# Altium project SPA_module.PrjPcb
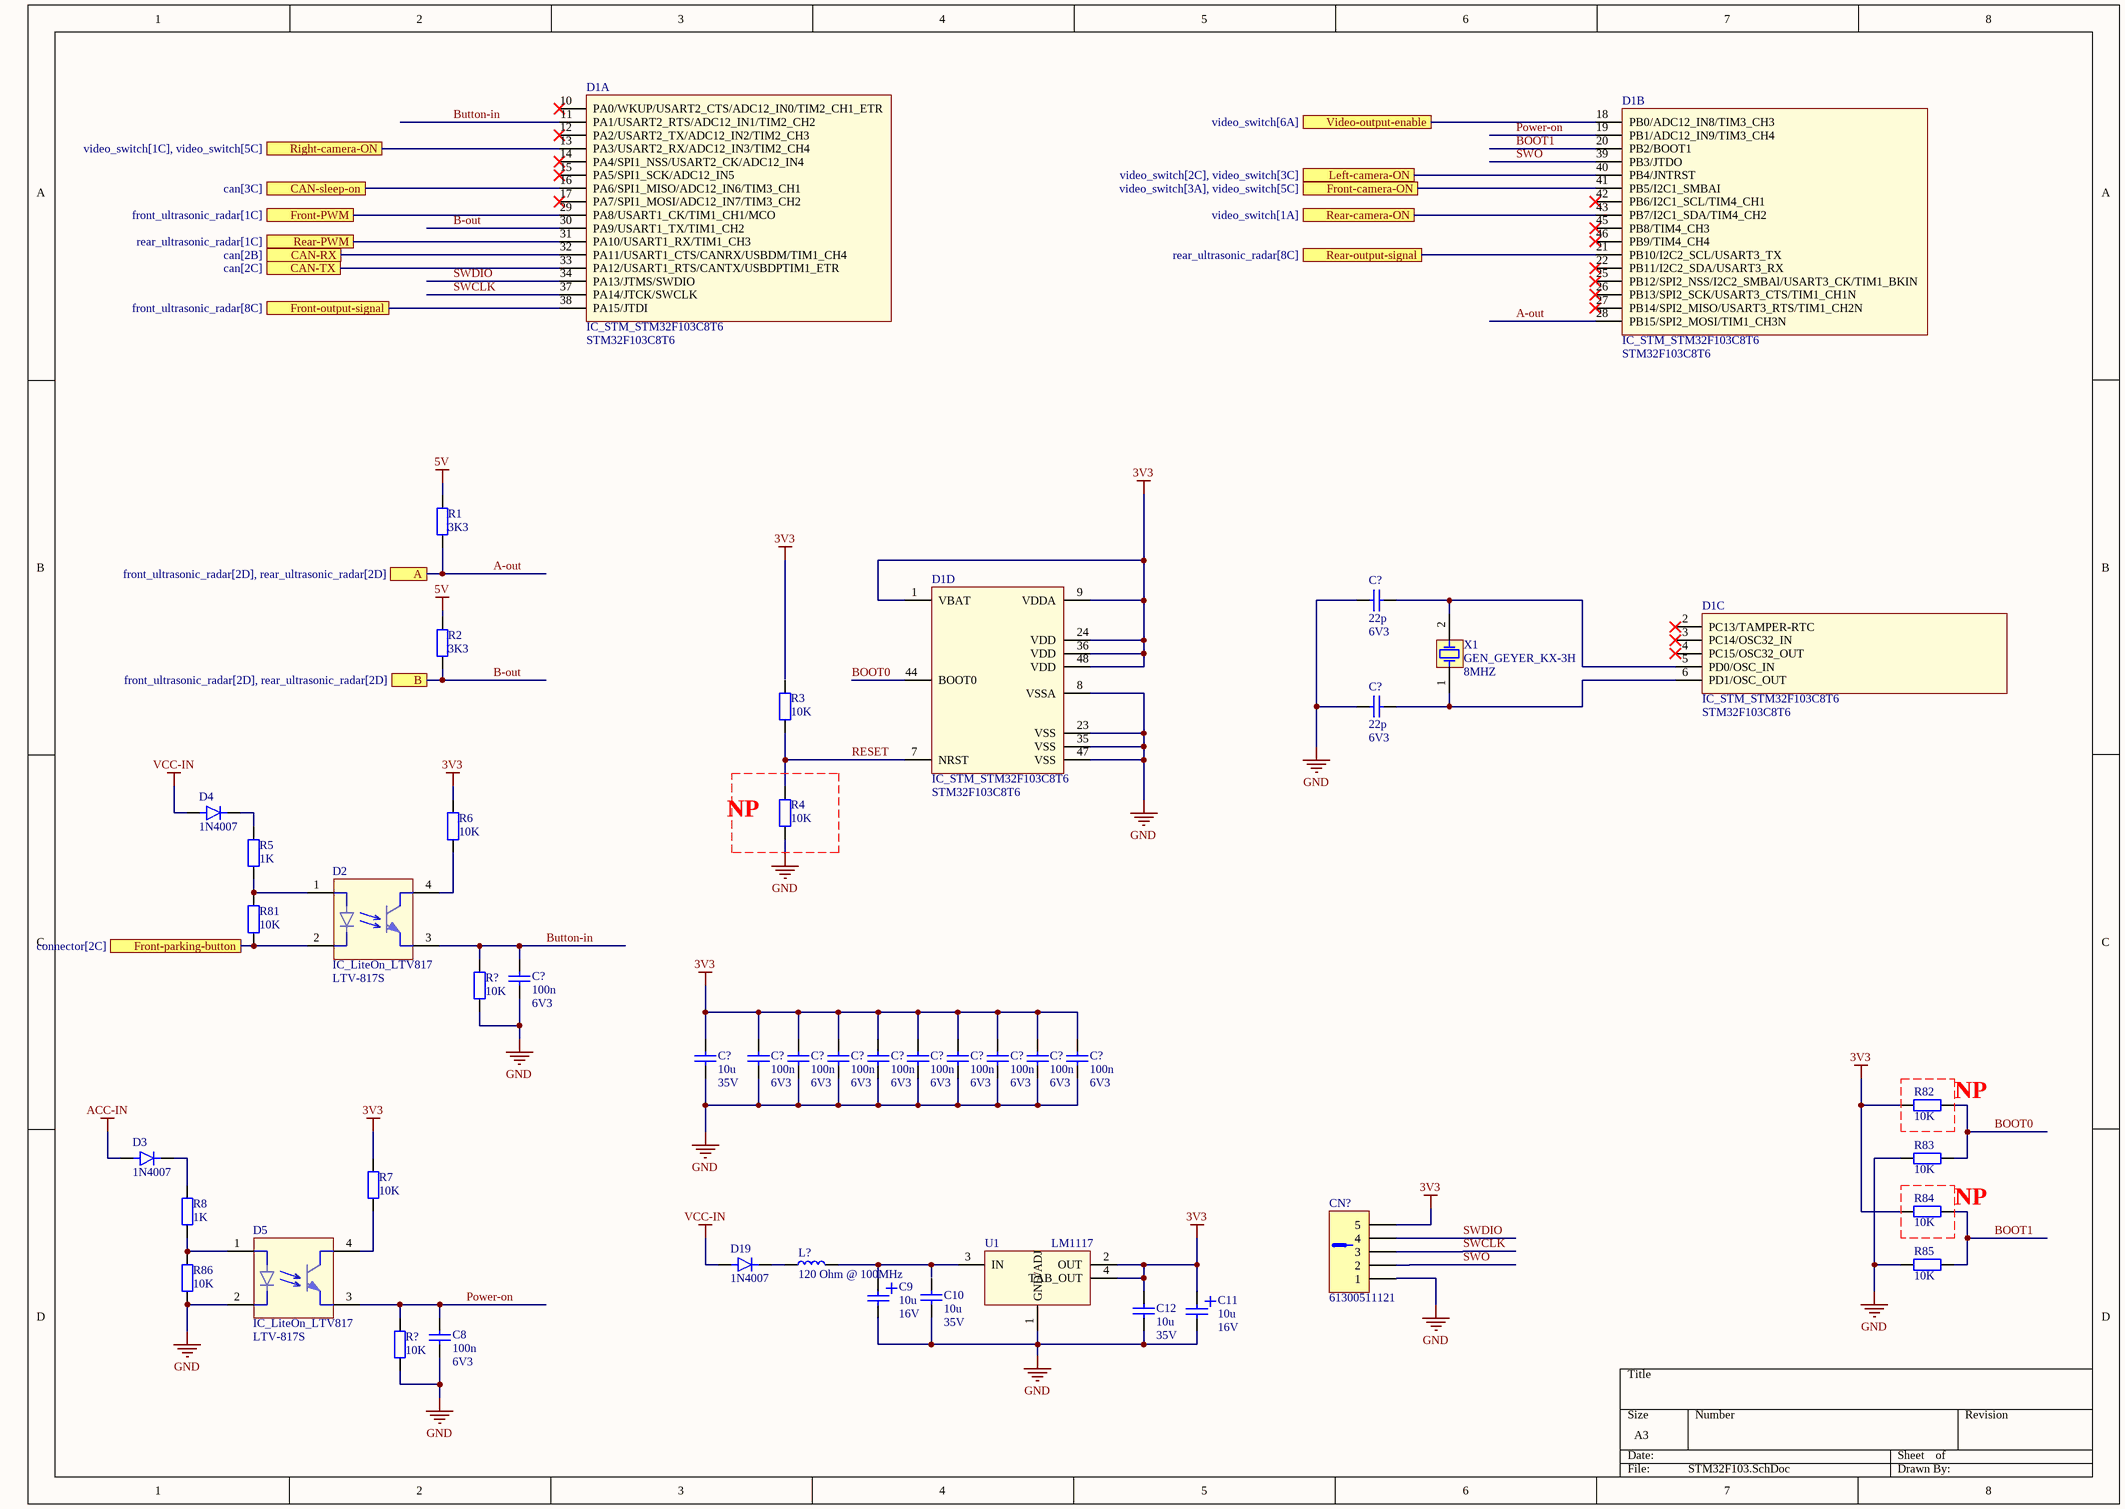
[diagram p0: STM32F103.SchDoc]
5 sheets, 153 parts. Net scope: flat (ports and power ports of the same name join across sheets).
Sheets:
  STM32F103.SchDoc
  can.SchDoc
  front_ultrasonic_radar.SchDoc
  connector.SchDoc
  rear_ultrasonic_radar.SchDoc

## Sheet STM32F103.SchDoc
size A3; SheetNumber: 1; SheetTotal: 6

### Parts
(Parts that share a designator on the sheet are numbered #1, #2 ... from top to bottom, then left to right.)
C8  Value1: 100n  Value2: 6V3  [CAPC2012X88N]  (hidden comment: CAP)
C9  Value1: 10u  Value2: 16V  [CAPAE430X550N]  (hidden comment: CAP_POL)
C10  Value1: 10u  Value2: 35V  [CAPC3216X18N]  (hidden comment: CAP)
C11  Value1: 10u  Value2: 16V  [CAPAE430X550N]  (hidden comment: CAP_POL)
C12  Value1: 10u  Value2: 35V  [CAPC3216X18N]  (hidden comment: CAP)
C?#1  Value1: 22p  Value2: 6V3  [CAPC2012X88N]  (hidden comment: CAP)
C?#2  Value1: 22p  Value2: 6V3  [CAPC2012X88N]  (hidden comment: CAP)
C?#3  Value1: 100n  Value2: 6V3  [CAPC2012X88N]  (hidden comment: CAP)
C?#4  Value1: 10u  Value2: 35V  [CAPC3216X18N]  (hidden comment: CAP)
C?#5  Value1: 100n  Value2: 6V3  [CAPC2012X88N]  (hidden comment: CAP)
C?#6  Value1: 100n  Value2: 6V3  [CAPC2012X88N]  (hidden comment: CAP)
C?#7  Value1: 100n  Value2: 6V3  [CAPC2012X88N]  (hidden comment: CAP)
C?#8  Value1: 100n  Value2: 6V3  [CAPC2012X88N]  (hidden comment: CAP)
C?#9  Value1: 100n  Value2: 6V3  [CAPC2012X88N]  (hidden comment: CAP)
C?#10  Value1: 100n  Value2: 6V3  [CAPC2012X88N]  (hidden comment: CAP)
C?#11  Value1: 100n  Value2: 6V3  [CAPC2012X88N]  (hidden comment: CAP)
C?#12  Value1: 100n  Value2: 6V3  [CAPC2012X88N]  (hidden comment: CAP)
C?#13  Value1: 100n  Value2: 6V3  [CAPC2012X88N]  (hidden comment: CAP)
CN?  Value1: 61300511121  [CN_Wurth_61300511121]  (hidden comment: CN_1X5M)
D1  IC_STM_STM32F103C8T6  Value1: STM32F103C8T6  [TSQFP50P900X900X160-48N]  (parts A,B,C,D of 4)
D2  IC_LiteOn_LTV817  Value1: LTV-817S  [IC_LiteOn_ LTV-817S]
D3  Value1: 1N4007  [DO-214AC]  (hidden comment: DIO)
D4  Value1: 1N4007  [DO-214AC]  (hidden comment: DIO)
D5  IC_LiteOn_LTV817  Value1: LTV-817S  [IC_LiteOn_ LTV-817S]
D19  Value1: 1N4007  [DO-214AC]  (hidden comment: DIO)
L?  Value1: 120 Ohm @ 100MHz  [INDC1608X60N]  (hidden comment: IND)
R1  Value1: 3K3  [RESC2012X60N]  (hidden comment: RES)
R2  Value1: 3K3  [RESC2012X60N]  (hidden comment: RES)
R3  Value1: 10K  [RESC2012X60N]  (hidden comment: RES)
R4  Value1: 10K  [RESC2012X60N]  (hidden comment: RES)
R5  Value1: 1K  [RESC2012X60N]  (hidden comment: RES)
R6  Value1: 10K  [RESC2012X60N]  (hidden comment: RES)
R7  Value1: 10K  [RESC2012X60N]  (hidden comment: RES)
R8  Value1: 1K  [RESC2012X60N]  (hidden comment: RES)
R81  Value1: 10K  [RESC2012X60N]  (hidden comment: RES)
R82  Value1: 10K  [RESC2012X60N]  (hidden comment: RES)
R83  Value1: 10K  [RESC2012X60N]  (hidden comment: RES)
R84  Value1: 10K  [RESC2012X60N]  (hidden comment: RES)
R85  Value1: 10K  [RESC2012X60N]  (hidden comment: RES)
R86  Value1: 10K  [RESC2012X60N]  (hidden comment: RES)
R?#1  Value1: 10K  [RESC2012X60N]  (hidden comment: RES)
R?#2  Value1: 10K  [RESC2012X60N]  (hidden comment: RES)
U1  Value1: LM1117  [IC_TI_LM1117]  (hidden comment: IC_TI_LM1117)
X1  GEN_GEYER_KX-3H  Value1: 8MHZ  [GEN_GEYER_KX-3H]

### Ports
A (see front_ultrasonic_radar[2D], rear_ultrasonic_radar[2D]), B (see front_ultrasonic_radar[2D], rear_ultrasonic_radar[2D]), CAN-RX (see can[2B]), CAN-sleep-on (see can[3C]), CAN-TX (see can[2C]), Front-camera-ON (see video_switch[3A], video_switch[5C]), Front-output-signal (see front_ultrasonic_radar[8C]), Front-parking-button (see connector[2C]), Front-PWM (see front_ultrasonic_radar[1C]), Left-camera-ON (see video_switch[2C], video_switch[3C]), Rear-camera-ON (see video_switch[1A]), Rear-output-signal (see rear_ultrasonic_radar[8C]), Rear-PWM (see rear_ultrasonic_radar[1C]), Right-camera-ON (see video_switch[1C], video_switch[5C]), Video-output-enable (see video_switch[6A])

### Nets
3V3: C11.1 C?#4.2 C?#5.2 C?#6.2 C?#7.2 C?#8.2 C?#9.2 C?#10.2 C?#11.2 C?#12.2 C?#13.2 CN?.5 D1.1(VBAT) D1.9(VDDA) D1.24(VDD) D1.36(VDD) D1.48(VDD) R6.2 R7.2 R82.1 R84.1 U1.2(OUT) U1.4(TAB_OUT)
5V: R1.2 R2.2
ACC-IN: D3.1(A)
GND: C8.1 C9.2 C10.1 C11.2 C12.1 C?#1.1 C?#2.1 C?#3.1 C?#4.1 C?#5.1 C?#6.1 C?#7.1 C?#8.1 C?#9.1 C?#10.1 C?#11.1 C?#12.1 C?#13.1 CN?.1 D1.8(VSSA) D1.23(VSS) D1.35(VSS) D1.47(VSS) D5.2 R4.1 R83.1 R85.1 R86.1 R?#1.1 R?#2.1 U1.1(GND/ADJ)
VCC-IN: D4.1(A) D19.1(A)
A-out: D1.28(PB15/SPI2_MOSI/TIM1_CH3N) R1.1 ; port A
B-out: D1.30(PA9/USART1_TX/TIM1_CH2) R2.1 ; port B
BOOT0: D1.44(BOOT0) R82.2 R83.2
BOOT1: D1.20(PB2/BOOT1) R84.2 R85.2
Button-in: C?#3.2 D1.11(PA1/USART2_RTS/ADC12_IN1/TIM2_CH2) D2.3 R?#1.2
Power-on: C8.2 D1.19(PB1/ADC12_IN9/TIM3_CH4) D5.3 R?#2.2
RESET: D1.7(NRST) R3.1
SWCLK: CN?.3 D1.37(PA14/JTCK/SWCLK)
SWDIO: CN?.4 D1.34(PA13/JTMS/SWDIO)
SWO: CN?.2 D1.39(PB3/JTDO)
NetC9_1: C9.1 L?.1 U1.3(IN)
NetC?#1_2: C?#1.2 D1.5(PD0/OSC_IN) X1.2
NetC?#2_2: C?#2.2 D1.6(PD1/OSC_OUT) X1.1
NetD1_13: D1.13(PA3/USART2_RX/ADC12_IN3/TIM2_CH4) ; port Right-camera-ON
NetD1_16: D1.16(PA6/SPI1_MISO/ADC12_IN6/TIM3_CH1) ; port CAN-sleep-on
NetD1_18: D1.18(PB0/ADC12_IN8/TIM3_CH3) ; port Video-output-enable
NetD1_21: D1.21(PB10/I2C2_SCL/USART3_TX) ; port Rear-output-signal
NetD1_29: D1.29(PA8/USART1_CK/TIM1_CH1/MCO) ; port Front-PWM
NetD1_31: D1.31(PA10/USART1_RX/TIM1_CH3) ; port Rear-PWM
NetD1_32: D1.32(PA11/USART1_CTS/CANRX/USBDM/TIM1_CH4) ; port CAN-RX
NetD1_33: D1.33(PA12/USART1_RTS/CANTX/USBDPTIM1_ETR) ; port CAN-TX
NetD1_38: D1.38(PA15/JTDI) ; port Front-output-signal
NetD1_40: D1.40(PB4/JNTRST) ; port Left-camera-ON
NetD1_41: D1.41(PB5/I2C1_SMBAI) ; port Front-camera-ON
NetD1_43: D1.43(PB7/I2C1_SDA/TIM4_CH2) ; port Rear-camera-ON
NetD2_1: D2.1 R5.1 R81.2
NetD2_2: D2.2 R81.1 ; port Front-parking-button
NetD2_4: D2.4 R6.1
NetD3_2: D3.2(K) R8.2
NetD4_2: D4.2(K) R5.2
NetD5_1: D5.1 R8.1 R86.2
NetD5_4: D5.4 R7.1
NetD19_2: D19.2(K) L?.2

Not connected (* = marked no-connect by the designer): C10 2; C12 2; D1 2(PC13/TAMPER-RTC)* 3(PC14/OSC32_IN)* 4(PC15/OSC32_OUT)* 10(PA0/WKUP/USART2_CTS/ADC12_IN0/TIM2_CH1_ETR)* 12(PA2/USART2_TX/ADC12_IN2/TIM2_CH3)* 14(PA4/SPI1_NSS/USART2_CK/ADC12_IN4)* 15(PA5/SPI1_SCK/ADC12_IN5)* 17(PA7/SPI1_MOSI/ADC12_IN7/TIM3_CH2)* 22(PB11/I2C2_SDA/USART3_RX)* 25(PB12/SPI2_NSS/I2C2_SMBAl/USART3_CK/TIM1_BKIN)* 26(PB13/SPI2_SCK/USART3_CTS/TIM1_CH1N)* 27(PB14/SPI2_MISO/USART3_RTS/TIM1_CH2N)* 42(PB6/I2C1_SCL/TIM4_CH1)* 45(PB8/TIM4_CH3)* 46(PB9/TIM4_CH4)*; R3 2; R4 2

### Notes on the sheet
- (near R4) NP
- (near R82) NP
- (near R84) NP

### Library data of the parts
C8 C?#3 C?#5-C?#13 = 01_00637: X7R 10% 0805; Manufacturer: KEMET; Manufacturer PN: C0805C104K9RACTU; AutoId: 637; DeviceType: capacitor; SubType: Ceramic; Id: 01_00637; Status: 2 - Checked and Approved; MountType: SMT; ComponentLink1URL: X:\01_Datasheets\CAP_KEMET_CxxxxCxxxXxRAC.pdf; Supplier 1: Farnell; Supplier Part Number 1: 80-C0805C104K9R; ComponentLink1Description: Datasheet
C9 C11 = 01_01399: ELCO 20%; Manufacturer: Nichicon; Manufacturer PN: UWF1C100MCL1GB; AutoId: 1399; DeviceType: capacitor; SubType: Electrolyte; Id: 01_01399; Status: 2 - Checked and Approved; MountType: SMT; ComponentLink1URL: X:\01_Datasheets\CAP_NICHICON_UWF1C100MCL1GB.pdf; Supplier 1: Farnell; Supplier Part Number 1: 647-UWF1C100MCL1GB; ComponentLink1Description: Datasheet
C10 C12 C?#4 = 01_01484: MURATA - GRM31CR6YA106KA12L - CAP, MLCC, X5R, 10UF, 35V, 1206; AutoId: 1484; DeviceType: capacitor; SubType: Ceramic; Id: 01_01484; Manufacturer: Murata; Manufacturer PN: GRM31CR6YA106KA12L; Status: 2 - Checked and Approved; MountType: SMD; ComponentLink1URL: X:\01_dataSheets\CAP_MURATA_GRM31CR6YA106KA12L.pdf; Supplier 1: Farnell; Supplier Part Number 1: 1797011; ComponentLink1Description: Datasheet
C?#1 C?#2 = 01_00593: X7R 10% 0805; Manufacturer: KEMET; Manufacturer PN: C0805C220K9RACTU; AutoId: 593; DeviceType: capacitor; SubType: Ceramic; Id: 01_00593; Status: 2 - Checked and Approved; MountType: SMT; ComponentLink1URL: X:\01_Datasheets\CAP_KEMET_CxxxxCxxxXxRAC.pdf; Supplier 1: Farnell; ComponentLink1Description: Datasheet
CN? = 02_00139: Headers & Wire Housings WR-PHD 2.54mm Hdr 5P Single Str Gold; Manufacturer: Wurth; AutoId: 139; Value2: 5 pin; Value3: header; DeviceType: Connector_; Id: 02_00139; Manufacturer PN: 61300511121; Status: 0 - Unchecked; MountType: THT; ComponentLink1Description: Datasheet; ComponentLink1URL: X:\01_Datasheets\CN_Wurth_61300511121.pdf; ComponentLink2Description: ComponentVerificationSheet; ComponentLink2URL: X:\02_ComponentVerificationSheets\; Supplier 1: Mouser; Supplier Part Number 1: 710-61300511121
D1 = 07_00285: MCU 32BIT Cortex M3 64KB 20KB RAM 2X12 ADC; Manufacturer: STM; AutoId: 292; Value2: Microcontroller; Value3: ARM 32bit; DeviceType: IC; Id: 07_00285; Manufacturer PN: STM32F103C8T6; Status: 0 - Unchecked; MountType: SMT; ComponentLink1Description: Datasheet; ComponentLink1URL: X:\01_Datasheets\IC_STM_STM32F103C8T6.pdf; ComponentLink2Description: ComponentVerificationSheet; ComponentLink2URL: X:\02_ComponentVerificationSheets\; Supplier 1: Mouser; Supplier Part Number 1: 511-STM32F103C8T6
D2 D5 = 07_00275: Transistor Output Optocouplers Optocoupler Phototrans; Manufacturer: Lite-On; AutoId: 276; Id: 07_00275; Value2: Optocouplers; Value3: Optocouplers; Manufacturer PN: LTV-817S; DeviceType: Optocouple; Status: 0 - Unchecked; MountType: SMT; ComponentLink1Description: Datasheet; ComponentLink1URL: X:\01_Datasheets\IC_Lite_On_LTV-817S.pdf; ComponentLink2Description: ComponentVerificationSheet; ComponentLink2URL: X:\02_ComponentVerificationSheets\; Supplier 1: Mouser; Supplier Part Number 1: 859-LTV-817S
D3 D4 D19 = 03_00099: M7 Diode, max 30A; AutoId: 117; Value2: 1A, 400V; Id: 03_00099; Value3: M7; Manufacturer PN: 1N4007; DeviceType: diode; ComponentLink1Description: Datasheet; ComponentLink1URL: X:\01_Datasheets\; ComponentLink2Description: ComponentVerificationSheet; ComponentLink2URL: X:\02_ComponentVerificationSheets\
L? = 08_00132: MURATA - BLM18KG121TN1D - FERRITE BEAD, 0603, 120R, 3A; AutoId: 132; DeviceType: inductor; Id: 08_00132; Value2: 3A; Manufacturer: Murata; Manufacturer PN: BLM18KG121TN1D; Status: 0 - Unchecked; MountType: SMD; ComponentLink1Description: Datasheet; ComponentLink1URL: X:\01_dataSheets\IND_MURATA_BLM18K.pdf; ComponentLink2Description: ComponentVerificationSheet; ComponentLink2URL: X:\02_ComponentVerificationSheets\; Supplier 1: Farnell; Supplier Part Number 1: 1781089
R1 R2 = 15_00335: RESISTOR, 0805, 3K3, 1%, SMD; Manufacturer: Yageo; Manufacturer PN: RC0805FR-073K3; AutoId: 335; Value2: 0W125; SubType: Metal film; Id: 15_00335; DeviceType: resistor; Status: 2 - Checked and Approved; MountType: SMT; ComponentLink1Description: Datasheet; ComponentLink1URL: X:\01_Datasheets\RES_YAGEO_RC0805FR.pdf; Supplier 1: Farnell; Supplier Part Number 1: 9237682
R3 R4 R6 R7 R81-R86 R?#1 R?#2 = 15_00341: RESISTOR, 0805, 10K, 1%, SMD; Manufacturer: Yageo; Manufacturer PN: RC0805FR-0710K; AutoId: 341; Value2: 0W125; SubType: Metal film; Id: 15_00341; DeviceType: resistor; Status: 0 - Unchecked; MountType: SMT; ComponentLink1Description: Datasheet; ComponentLink1URL: X:\01_Datasheets\RES_YAGEO_RC0805FR.pdf; Supplier 1: Farnell
R5 R8 = 15_00329: RESISTOR, 0805, 1K, 1%, SMD; Manufacturer: Yageo; Manufacturer PN: RC0805FR-071K; AutoId: 329; Value2: 0W125; SubType: Metal film; Id: 15_00329; DeviceType: resistor; Status: 2 - Checked and Approved; MountType: SMT; ComponentLink1Description: Datasheet; ComponentLink1URL: X:\01_Datasheets\RES_YAGEO_RC0805FR.pdf; Supplier 1: Farnell; Supplier Part Number 1: 9237496
U1 = 07_00244: LDO Voltage Regulators 800MA LDO LINEAR REG; Manufacturer: TI; Manufacturer PN: LM1117MPX-3.3/NOPB; AutoId: 242; Value3: 3V3; Id: 07_00244; Value2: LDO; DeviceType: LDO; Status: 0 - Unchecked; MountType: SMT; ComponentLink1Description: Datasheet; ComponentLink1URL: X:\01_Datasheets\IC_TI_LM1117.pdf; ComponentLink2Description: ComponentVerificationSheet; ComponentLink2URL: X:\02_ComponentVerificationSheets\; Supplier 1: Mouser; Supplier Part Number 1: 926-LM1117MPX3.3NOPB
X1 = 06_00035: Crystals 8MHz; Manufacturer: GEYER; Manufacturer PN: KX-3H HC49S-8.000MHZ-20PF; AutoId: 36; Value2: 20 pF; Id: 06_00035; DeviceType: crystal; Status: 0 - Unchecked; MountType: SMT; ComponentLink1Description: Datasheet; ComponentLink1URL: X:\01_Datasheets\GEN_GEYER_KX-3H.pdf; ComponentLink2Description: ComponentVerificationSheet; ComponentLink2URL: X:\02_ComponentVerificationSheets\

## Sheet can.SchDoc
size A4; SheetNumber: 3; SheetTotal: 6
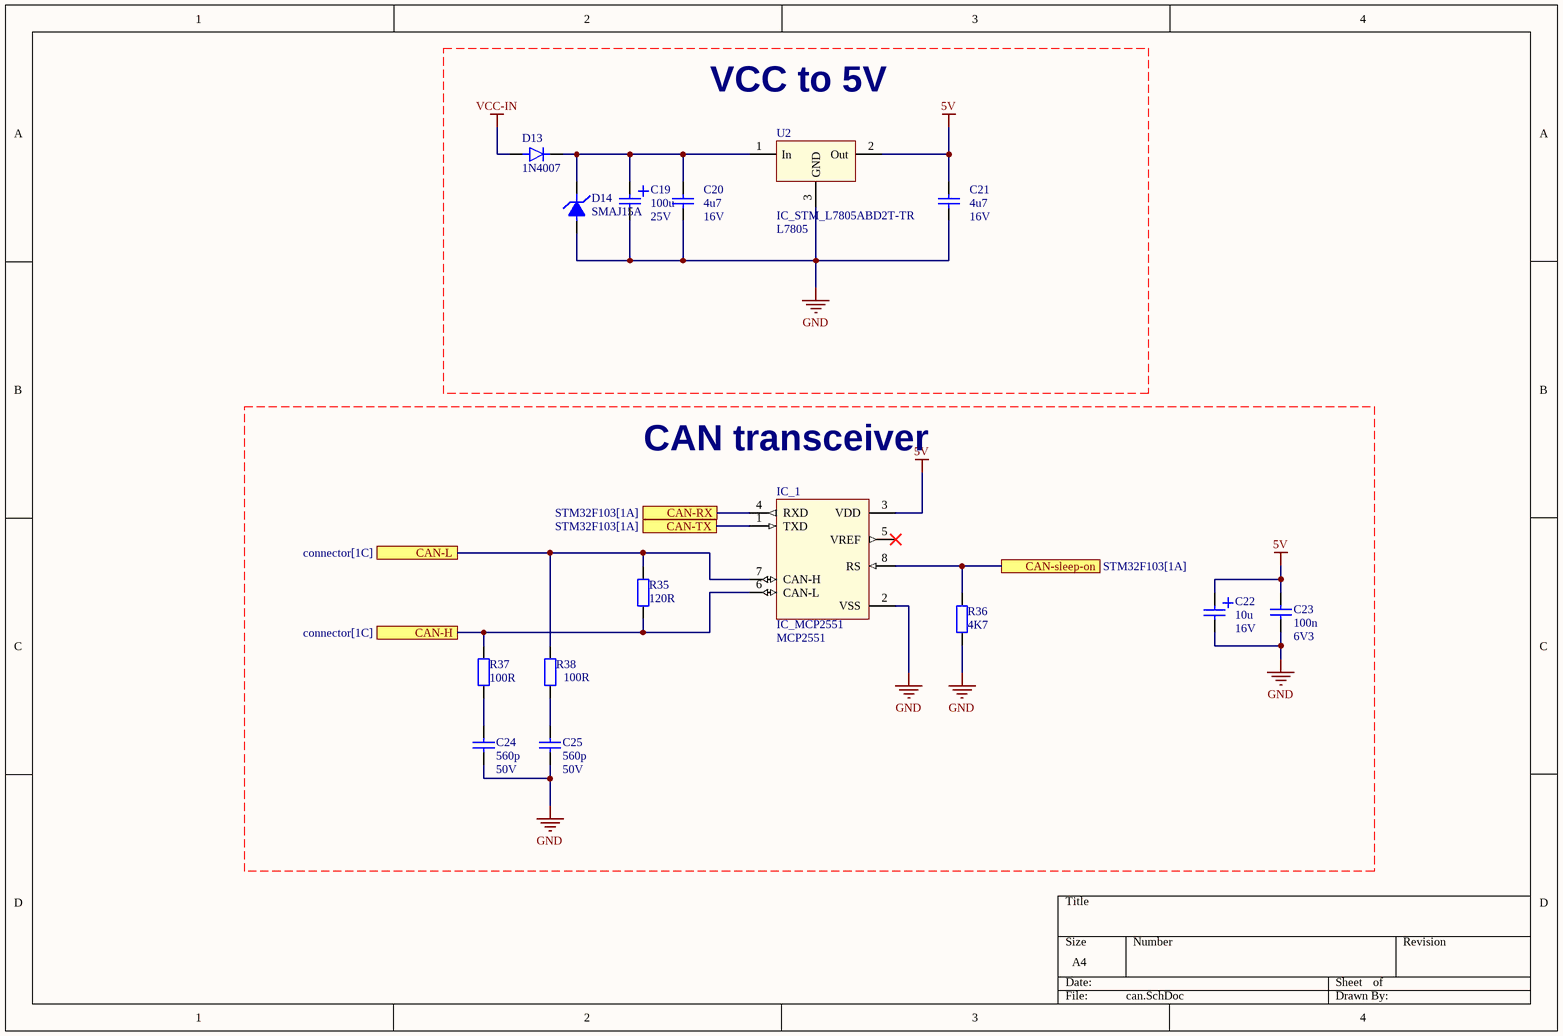
[diagram p1: can.SchDoc]

### Parts
C19  Value1: 100u  Value2: 25V  [CAPAE9983X102N]  (hidden comment: CAP_POL)
C20  Value1: 4u7  Value2: 16V  [CAPC2012X140N]  (hidden comment: CAP)
C21  Value1: 4u7  Value2: 16V  [CAPC2012X140N]  (hidden comment: CAP)
C22  Value1: 10u  Value2: 16V  [CAPAE430X550N]  (hidden comment: CAP_POL)
C23  Value1: 100n  Value2: 6V3  [CAPC2012X88N]  (hidden comment: CAP)
C24  Value1: 560p  Value2: 50V  [CAPC2012X88N]  (hidden comment: CAP)
C25  Value1: 560p  Value2: 50V  [CAPC2012X88N]  (hidden comment: CAP)
D13  Value1: 1N4007  [DO-214AC]  (hidden comment: DIO)
D14  Value1: SMAJ15A  [DO-214AC]  (hidden comment: DIO_UNIDIRECTIONAL_TVS)
IC_1  IC_MCP2551  Value1: MCP2551  [SOIC-8N]
R35  Value1: 120R  [RESC2012X60N]  (hidden comment: RES)
R36  Value1: 4K7  [RESC2012X60N]  (hidden comment: RES)
R37  Value1: 100R  [RESC2012X60N]  (hidden comment: RES)
R38  Value1: 100R  [RESC2012X60N]  (hidden comment: RES)
U2  IC_STM_L7805ABD2T-TR  Value1: L7805  [IC_STM_L7805ABD2T-TR]

### Ports
CAN-H (see connector[1C]), CAN-L (see connector[1C]), CAN-RX (see STM32F103[1A]), CAN-sleep-on (see STM32F103[1A]), CAN-TX (see STM32F103[1A])

### Nets
5V: C21.1 C22.1 C23.2 IC_1.3(VDD) U2.2(Out)
GND: C19.2 C20.2 C21.2 C22.2 C23.1 C24.1 C25.1 D14.1 IC_1.2(VSS) R36.1 U2.3(GND)
VCC-IN: D13.1(A)
NetC19_1: C19.1 C20.1 D13.2(K) D14.2 U2.1(In)
NetC24_2: C24.2 R37.1
NetC25_2: C25.2 R38.1
NetD1_16: IC_1.8(RS) R36.2 ; port CAN-sleep-on
NetD1_32: IC_1.4(RXD) ; port CAN-RX
NetD1_33: IC_1.1(TXD) ; port CAN-TX
NetIC_1_6: IC_1.6(CAN-L) R35.1 R37.2 ; port CAN-H
NetIC_1_7: IC_1.7(CAN-H) R35.2 R38.2 ; port CAN-L

Not connected (* = marked no-connect by the designer): IC_1 5(VREF)*

### Notes on the sheet
- (near U2) VCC to 5V
- (near IC_1) CAN transceiver

### Library data of the parts
C19 = 01_01471: PANASONIC - EEEFC1E101AP - CAP, ALU ELEC, 100UF, 25V, SMD, REEL; AutoId: 1471; DeviceType: capacitor; SubType: Electrolyte; Id: 01_01471; Manufacturer: Panasonic; Manufacturer PN: EEEFC1E101AP; Status: 0 - Unchecked; MountType: SMD; ComponentLink1URL: X:\01_dataSheets\CAP_PANASONIC_EEUFCXXXXXX.pdf; Supplier 1: Farnell; Supplier Part Number 1: 2254349; ComponentLink1Description: Datasheet
C20 C21 = 01_01402: X7R 10% 0805; Manufacturer: MURATA; Manufacturer PN: GRM21BR71C475KA73L; AutoId: 1402; DeviceType: capacitor; SubType: Ceramic; Id: 01_01402; Status: 2 - Checked and Approved; MountType: SMD; ComponentLink1URL: X:\01_DataSheets\CAP_MURATA_GRM.pdf; Supplier 1: Farnell; Supplier Part Number 1: 1797015; ComponentLink1Description: Datasheet
C22 = 01_01399: as C9 on sheet STM32F103; Id: 01_01399; Status: 2 - Checked and Approved; MountType: SMT; ComponentLink1URL: X:\01_Datasheets\CAP_NICHICON_UWF1C100MCL1GB.pdf; Supplier 1: Farnell; Supplier Part Number 1: 647-UWF1C100MCL1GB; ComponentLink1Description: Datasheet
C23 = 01_00637: as C8 on sheet STM32F103; Id: 01_00637; Status: 2 - Checked and Approved; MountType: SMT; ComponentLink1URL: X:\01_Datasheets\CAP_KEMET_CxxxxCxxxXxRAC.pdf; Supplier 1: Farnell; Supplier Part Number 1: 80-C0805C104K9R; ComponentLink1Description: Datasheet
C24 C25 = 01_01464: YAGEO (PHYCOMP) - CC0805JRNPO9BN561 - CAP, MLCC, C0G/NP0, 560PF, 50V, 0805; AutoId: 1464; DeviceType: capacitor; SubType: Ceramic; Id: 01_01464; Manufacturer: YAGEO; Manufacturer PN: CC0805JRNPO9BN561; Status: 0 - Unchecked; MountType: SMD; ComponentLink1URL: X:\01_Datasheets\CAP_YAGEO_CC0805_NP0.pdf; Supplier 1: Farnell; Supplier Part Number 1: 718531; ComponentLink1Description: Datasheet
D13 = 03_00099: as D3 on sheet STM32F103; Id: 03_00099; Value3: M7; Manufacturer PN: 1N4007; DeviceType: diode; ComponentLink1Description: Datasheet; ComponentLink1URL: X:\01_Datasheets\; ComponentLink2Description: ComponentVerificationSheet; ComponentLink2URL: X:\02_ComponentVerificationSheets\
D14 = 03_00100: Transient Voltage Suppressors; Manufacturer: Littelfuse; AutoId: 118; Value2: 15Vr 400W 16.4A; Value3: TVS; DeviceType: diode; Id: 03_00100; Manufacturer PN: SMAJ15A; Status: 0 - Unchecked; MountType: SMD; ComponentLink1Description: Datasheet; ComponentLink1URL: X:\01_Datasheets\DIO_Littelfuse_SMAJ58A.pdf; ComponentLink2Description: ComponentVerificationSheet; ComponentLink2URL: X:\02_ComponentVerificationSheets\; Supplier Part Number 1: SMAJ15A
IC_1 = 07_00296: High-speed CAN transceiver; Manufacturer: Microchip; AutoId: 304; DeviceType: IC; Id: 07_00296; Manufacturer PN: MCP2551; Status: 0 - Unchecked; MountType: SMT; ComponentLink1Description: Datasheet; ComponentLink1URL: X:\01_Datasheets\mcp2551.pdf; ComponentLink2Description: ComponentVerificationSheet; ComponentLink2URL: X:\02_ComponentVerificationSheets\
R35 = 15_00318: RESISTOR, 0805, 120R, 1%, SMD; Manufacturer: Yageo; Manufacturer PN: RC0805FR-07120R; AutoId: 318; Value2: 0W125; SubType: Metal film; Id: 15_00318; DeviceType: resistor; Status: 2 - Checked and Approved; MountType: SMT; ComponentLink1Description: Datasheet; ComponentLink1URL: X:\01_Datasheets\RES_YAGEO_RC0805FR.pdf; Supplier 1: Farnell; Supplier Part Number 1: 9237372
R36 = 15_00337: RESISTOR, 0805, 4K7, 1%, SMD; Manufacturer: Yageo; Manufacturer PN: RC0805FR-074K7; AutoId: 337; Value2: 0W125; SubType: Metal film; Id: 15_00337; DeviceType: resistor; Status: 2 - Checked and Approved; MountType: SMT; ComponentLink1Description: Datasheet; ComponentLink1URL: X:\01_Datasheets\RES_YAGEO_RC0805FR.pdf; Supplier 1: Farnell; Supplier Part Number 1: 9237704
R37 R38 = 15_00317: RESISTOR, 0805, 100R, 1%, SMD; Manufacturer: Yageo; Manufacturer PN: RC0805FR-07100R; AutoId: 317; Value2: 0W125; SubType: Metal film; Id: 15_00317; DeviceType: resistor; Status: 2 - Checked and Approved; MountType: SMT; ComponentLink1Description: Datasheet; ComponentLink1URL: X:\01_Datasheets\RES_YAGEO_RC0805FR.pdf; Supplier 1: Farnell; Supplier Part Number 1: 9237364
U2 = 07_00226: Linear Voltage Regulators 5.0V 1.0A Positive; Manufacturer: STM; AutoId: 226; Value2: LDO; Id: 07_00226; Value3: LDO; Manufacturer PN: L7805ABD2T-TR; DeviceType: LDO; Status: 0 - Unchecked; MountType: SMT; ComponentLink1Description: Datasheet; ComponentLink1URL: X:\01_Datasheets\IC_STM_L7805ABD2T-TR.pdf; ComponentLink2Description: ComponentVerificationSheet; ComponentLink2URL: X:\02_ComponentVerificationSheets\; Supplier 1: Mouser; Supplier Part Number 1: 511-L7805ABD2T-TR

## Sheet front_ultrasonic_radar.SchDoc
size A3; SheetNumber: 4; SheetTotal: 6
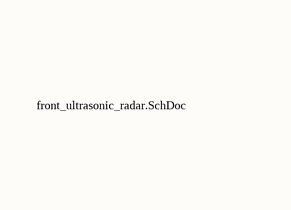
[diagram p2: front_ultrasonic_radar.SchDoc, left]
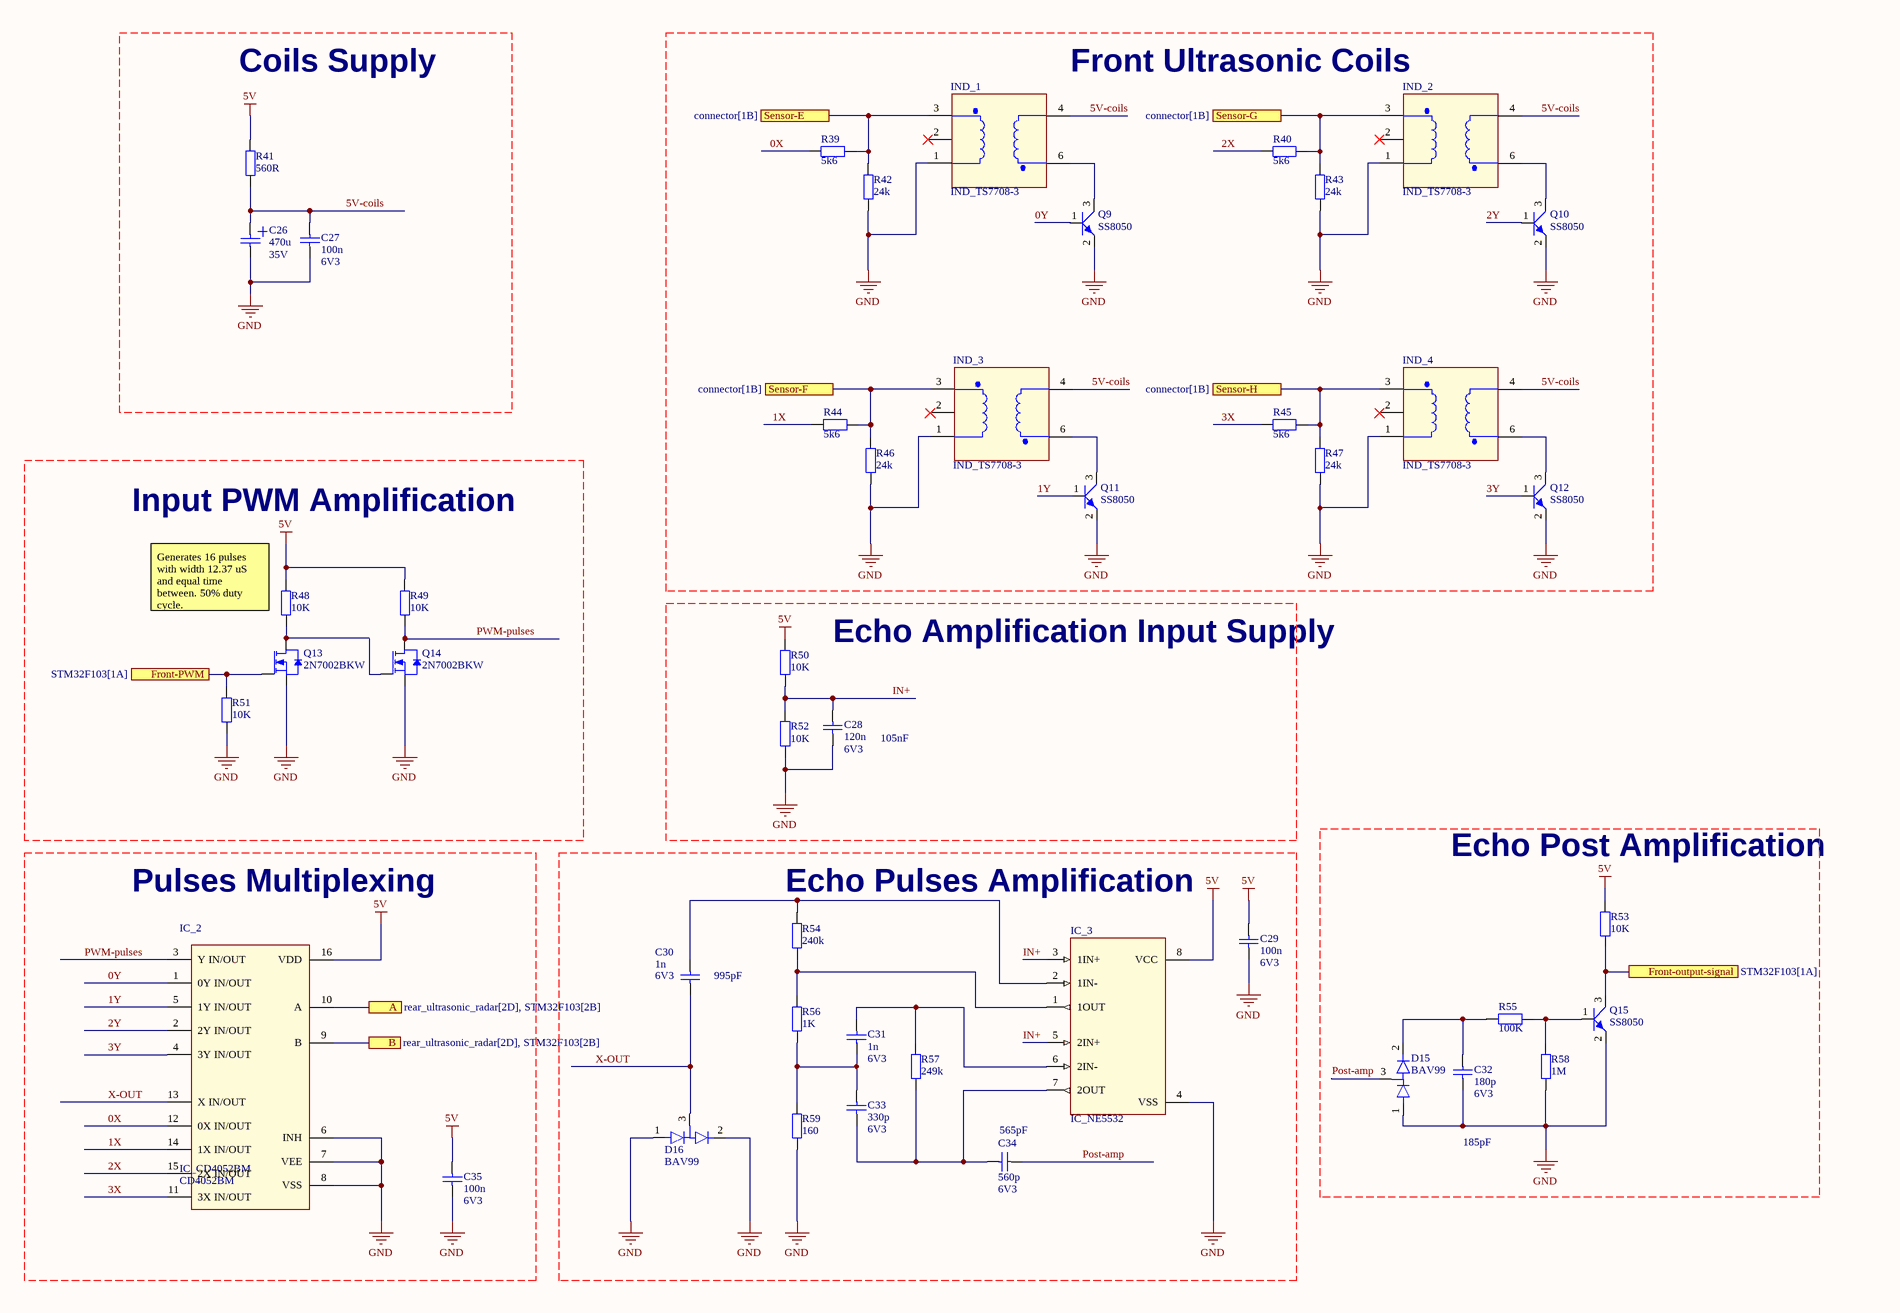
[diagram p3: front_ultrasonic_radar.SchDoc, right]

### Parts
C26  Value1: 470u  Value2: 35V  [CAP_Panasonic_EEE-FK1V471SP]  (hidden comment: CAP_POL)
C27  Value1: 100n  Value2: 6V3  [CAPC2012X88N]  (hidden comment: CAP)
C28  Value1: 120n  Value2: 6V3  [CAPC2012X88N]  (hidden comment: CAP)
C29  Value1: 100n  Value2: 6V3  [CAPC2012X88N]  (hidden comment: CAP)
C30  Value1: 1n  Value2: 6V3  [CAPC2012X88N]  (hidden comment: CAP)
C31  Value1: 1n  Value2: 6V3  [CAPC2012X88N]  (hidden comment: CAP)
C32  Value1: 180p  Value2: 6V3  [CAPC2012X88N]  (hidden comment: CAP)
C33  Value1: 330p  Value2: 6V3  [CAPC2012X88N]  (hidden comment: CAP)
C34  Value1: 560p  Value2: 6V3  [CAPC2012X88N]  (hidden comment: CAP)
C35  Value1: 100n  Value2: 6V3  [CAPC2012X88N]  (hidden comment: CAP)
D15  Value1: BAV99  [DIO_BAV99-SOT23]  (hidden comment: High-speed double diode)
D16  Value1: BAV99  [DIO_BAV99-SOT23]  (hidden comment: High-speed double diode)
IC_2  IC_CD4052BM  Value1: CD4052BM  [SOP-16]
IC_3  IC_NE5532
IND_1  IND_TS7708-3
IND_2  IND_TS7708-3
IND_3  IND_TS7708-3
IND_4  IND_TS7708-3
Q9  Value1: SS8050  [SOT23]  (hidden comment: TRS_NPN_123)
Q10  Value1: SS8050  [SOT23]  (hidden comment: TRS_NPN_123)
Q11  Value1: SS8050  [SOT23]  (hidden comment: TRS_NPN_123)
Q12  Value1: SS8050  [SOT23]  (hidden comment: TRS_NPN_123)
Q13  Value1: 2N7002BKW  [SOT65P210X110-3N]  (hidden comment: TRS_FETN_123)
Q14  Value1: 2N7002BKW  [SOT65P210X110-3N]  (hidden comment: TRS_FETN_123)
Q15  Value1: SS8050  [SOT23]  (hidden comment: TRS_NPN_123)
R39  Value1: 5k6  [RESC2012X60N]  (hidden comment: RES)
R40  Value1: 5k6  [RESC2012X60N]  (hidden comment: RES)
R41  Value1: 560R  [RESC2012X60N]  (hidden comment: RES)
R42  Value1: 24k  [RESC2012X60N]  (hidden comment: RES)
R43  Value1: 24k  [RESC2012X60N]  (hidden comment: RES)
R44  Value1: 5k6  [RESC2012X60N]  (hidden comment: RES)
R45  Value1: 5k6  [RESC2012X60N]  (hidden comment: RES)
R46  Value1: 24k  [RESC2012X60N]  (hidden comment: RES)
R47  Value1: 24k  [RESC2012X60N]  (hidden comment: RES)
R48  Value1: 10K  [RESC2012X60N]  (hidden comment: RES)
R49  Value1: 10K  [RESC2012X60N]  (hidden comment: RES)
R50  Value1: 10K  [RESC2012X60N]  (hidden comment: RES)
R51  Value1: 10K  [RESC2012X60N]  (hidden comment: RES)
R52  Value1: 10K  [RESC2012X60N]  (hidden comment: RES)
R53  Value1: 10K  [RESC2012X60N]  (hidden comment: RES)
R54  Value1: 240k  [RESC2012X60N]  (hidden comment: RES)
R55  Value1: 100K  [RESC2012X60N]  (hidden comment: RES)
R56  Value1: 1K  [RESC2012X60N]  (hidden comment: RES)
R57  Value1: 249k  [RESC2012X60N]  (hidden comment: RES)
R58  Value1: 1M  [RESC2012X60N]  (hidden comment: RES)
R59  Value1: 160  [RESC2012X60N]  (hidden comment: RES)

### Ports
A (see rear_ultrasonic_radar[2D], STM32F103[2B]), B (see rear_ultrasonic_radar[2D], STM32F103[2B]), Front-output-signal (see STM32F103[1A]), Front-PWM (see STM32F103[1A]), Sensor-E (see connector[1B]), Sensor-F (see connector[1B]), Sensor-G (see connector[1B]), Sensor-H (see connector[1B])

### Nets
5V: C29.2 C35.2 IC_2.16(VDD) IC_3.8(VCC) R41.2 R48.2 R49.2 R50.1 R53.2
GND: C26.2 C27.1 C28.1 C29.1 C32.1 C35.1 D15.1(A1) D16.1(A1) D16.2(A2) IC_2.6(INH) IC_2.7(VEE) IC_2.8(VSS) IC_3.4(VSS) IND_1.1 IND_2.1 IND_3.1 IND_4.1 Q9.2(E) Q10.2(E) Q11.2(E) Q12.2(E) Q13.2(S) Q14.2(S) Q15.2(E) R42.1 R43.1 R46.1 R47.1 R51.1 R52.1 R58.1 R59.1
0X: IC_2.12(0X_IN/OUT) R39.2
0Y: IC_2.1(0Y_IN/OUT) Q9.1(B)
1X: IC_2.14(1X_IN/OUT) R44.2
1Y: IC_2.5(1Y_IN/OUT) Q11.1(B)
2X: IC_2.15(2X_IN/OUT) R40.2
2Y: IC_2.2(2Y_IN/OUT) Q10.1(B)
3X: IC_2.11(3X_IN/OUT) R45.2
3Y: IC_2.4(3Y_IN/OUT) Q12.1(B)
5V-coils: C26.1 C27.2 IND_1.4 IND_2.4 IND_3.4 IND_4.4 R41.1
A-out: IC_2.10(A) ; port A
B-out: IC_2.9(B) ; port B
IN+: C28.2 IC_3.3(1IN+) IC_3.5(2IN+) R50.2 R52.2
Post-amp: C34.1 D15.3(K)
PWM-pulses: IC_2.3(Y_IN/OUT) Q14.3(D) R49.1
X-OUT: C30.1 D16.3(K) IC_2.13(X_IN/OUT)
NetC30_2: C30.2 IC_3.2(1IN-) R54.1
NetC31_1: C31.1 IC_3.6(2IN-) R57.1
NetC31_2: C31.2 C33.2 R56.1 R59.2
NetC32_2: C32.2 D15.2(A2) R55.1
NetC33_1: C33.1 C34.2 IC_3.7(2OUT) R57.2
NetD1_29: Q13.1(G) R51.2 ; port Front-PWM
NetD1_38: Q15.3(C) R53.1 ; port Front-output-signal
NetIC_3_1: IC_3.1(1OUT) R54.2 R56.2
NetIND_1_3: IND_1.3(S2) R39.1 R42.2 ; port Sensor-E
NetIND_1_6: IND_1.6(S1) Q9.3(C)
NetIND_2_3: IND_2.3(S2) R40.1 R43.2 ; port Sensor-G
NetIND_2_6: IND_2.6(S1) Q10.3(C)
NetIND_3_3: IND_3.3(S2) R44.1 R46.2 ; port Sensor-F
NetIND_3_6: IND_3.6(S1) Q11.3(C)
NetIND_4_3: IND_4.3(S2) R45.1 R47.2 ; port Sensor-H
NetIND_4_6: IND_4.6(S1) Q12.3(C)
NetQ13_3: Q13.3(D) Q14.1(G) R48.1
NetQ15_1: Q15.1(B) R55.2 R58.2

Not connected (* = marked no-connect by the designer): IND_1 2*; IND_2 2*; IND_3 2*; IND_4 2*

### Notes on the sheet
- Coils Supply
- Front Ultrasonic Coils
- Input PWM Amplification
- (near R48) Generates 16 pulses with width 12.37 uS and equal time between. 50% duty cycle.
- front_ultrasonic_radar.SchDoc
- Echo Amplification Input Supply
- (near C28) 105nF
- (near R53) Echo Post Amplification
- Pulses Multiplexing
- (near R54) Echo Pulses Amplification
- (near C30) 995pF
- (near C34) 565pF
- 185pF

### Library data of the parts
C26 = 01_01555: Aluminium Electrolytic Capacitors - SMD 35volts 470uF SMD AEC-Q200 Reflow Only; Manufacturer: Panasonic; Manufacturer PN: EEE-FK1V471SP; AutoId: 1556; SubType: Electrolyte; Id: 01_01555; DeviceType: capacitor; Status: 0 - Unchecked; MountType: SMT; ComponentLink1URL: X:\01_Datasheets\CAP_Panasonic_FKS.pdf; Supplier 1: Mouser; Supplier Part Number 1: 667-EEE-FK1V471SP; ComponentLink1Description: Datasheet
C27 C29 C35 = 01_00637: as C8 on sheet STM32F103; Id: 01_00637; Status: 2 - Checked and Approved; MountType: SMT; ComponentLink1URL: X:\01_Datasheets\CAP_KEMET_CxxxxCxxxXxRAC.pdf; Supplier 1: Farnell; Supplier Part Number 1: 80-C0805C104K9R; ComponentLink1Description: Datasheet
C28 = 01_00638: X7R 10% 0805; Manufacturer: KEMET; Manufacturer PN: C0805C124K9RACTU; AutoId: 638; DeviceType: capacitor; SubType: Ceramic; Id: 01_00638; Status: 2 - Checked and Approved; MountType: SMT; ComponentLink1URL: X:\01_Datasheets\CAP_KEMET_CxxxxCxxxXxRAC.pdf; Supplier 1: Farnell; ComponentLink1Description: Datasheet
C30 C31 = 01_00613: X7R 10% 0805; Manufacturer: KEMET; Manufacturer PN: C0805C102K9RACTU; AutoId: 613; DeviceType: capacitor; SubType: Ceramic; Id: 01_00613; Status: 2 - Checked and Approved; MountType: SMT; ComponentLink1URL: X:\01_Datasheets\CAP_KEMET_CxxxxCxxxXxRAC.pdf; Supplier 1: Farnell; ComponentLink1Description: Datasheet
C32 = 01_00604: X7R 10% 0805; Manufacturer: KEMET; Manufacturer PN: C0805C181K9RACTU; AutoId: 604; DeviceType: capacitor; SubType: Ceramic; Id: 01_00604; Status: 2 - Checked and Approved; MountType: SMT; ComponentLink1URL: X:\01_Datasheets\CAP_KEMET_CxxxxCxxxXxRAC.pdf; Supplier 1: Farnell; ComponentLink1Description: Datasheet
C33 = 01_00607: X7R 10% 0805; Manufacturer: KEMET; Manufacturer PN: C0805C331K9RACTU; AutoId: 607; DeviceType: capacitor; SubType: Ceramic; Id: 01_00607; Status: 2 - Checked and Approved; MountType: SMT; ComponentLink1URL: X:\01_Datasheets\CAP_KEMET_CxxxxCxxxXxRAC.pdf; Supplier 1: Farnell; ComponentLink1Description: Datasheet
C34 = 01_00610: X7R 10% 0805; Manufacturer: KEMET; Manufacturer PN: C0805C561K9RACTU; AutoId: 610; DeviceType: capacitor; SubType: Ceramic; Id: 01_00610; Status: 2 - Checked and Approved; MountType: SMT; ComponentLink1URL: X:\01_Datasheets\CAP_KEMET_CxxxxCxxxXxRAC.pdf; Supplier 1: Farnell; ComponentLink1Description: Datasheet
D15 D16 = 03_00102: Manufacturer: Philips; AutoId: 120; Value2: 75В 215mА; Value3: Ultra fast; Id: 03_00102; Manufacturer PN: BAV99; DeviceType: diode; Status: 0 - Unchecked; MountType: SMD; ComponentLink1Description: Datasheet; ComponentLink1URL: X:\01_Datasheets\BAV99.pdf; ComponentLink2Description: ComponentVerificationSheet; ComponentLink2URL: X:\02_ComponentVerificationSheets\
IC_2 = 07_00294: Dual 4-Channel Analog Multiplexer/Demultiplexer; Manufacturer: Texas Instruments; AutoId: 301; Value2: 16 pin  Multiplexer/Demultiplexer; DeviceType: IC; Id: 07_00294; Manufacturer PN: CD4052BM; Status: 0 - Unchecked; MountType: SMT; ComponentLink1Description: Datasheet; ComponentLink1URL: X:\01_Datasheets\IC_CD4052BM.pdf; ComponentLink2Description: ComponentVerificationSheet; ComponentLink2URL: X:\02_ComponentVerificationSheets\
IC_3 = IC_NE5532: Dual low-noise operational amplifier 
IND_1-IND_4 = IND_TS7708-3: 12times Amplifying Transformer,IFT Inductors for Ultrasonic Sensors
Q9-Q12 Q15 = 19_00050: Bipolar Transistors - BJT NPN TRANSISTOR 1.5A 40V; Manufacturer: KooChin; AutoId: 57; Value2: 40V 1,5A; Id: 19_00050; Manufacturer PN: SS8050; DeviceType: transistor; SubType: NPN; Status: 0 - Unchecked; MountType: SMT; ComponentLink1Description: Datasheet; ComponentLink1URL: X:\01_Datasheets\SS8050.pdf; ComponentLink2Description: ComponentVerificationSheet; ComponentLink2URL: X:\02_ComponentVerificationSheets\
Q13 Q14 = 19_00024: NXP - 2N7002BKW - MOSFET, N CH, 60V, 0.31A, SOT323; AutoId: 24; DeviceType: transistor; Id: 19_00024; Value2: n/a; Manufacturer: NXP; Manufacturer PN: 2N7002BKW; SubType: MOSFET; Status: 2 - Checked and Approved; MountType: SMD; ComponentLink1Description: Datasheet; ComponentLink1URL: X:\01_dataSheets\TRS_NXP_2N7002BKW.pdf; ComponentLink2Description: ComponentVerificationSheet; ComponentLink2URL: X:\02_ComponentVerificationSheets\; Supplier 1: Farnell; Supplier Part Number 1: 1894713RL
R39 R40 R44 R45 = 15_10611: RESISTOR, 0805, 5k6, 1%, SMD; Manufacturer: Yageo; AutoId: 674; Value2: 0W125; SubType: Metal film; Id: 15_10611; DeviceType: resistor; Status: 0 - Unchecked; MountType: SMT; ComponentLink1Description: Datasheet; ComponentLink1URL: X:\01_Datasheets\
R41 = 15_00326: RESISTOR, 0805, 560R, 1%, SMD; Manufacturer: Yageo; Manufacturer PN: RC0805FR-07560R; AutoId: 326; Value2: 0W125; SubType: Metal film; Id: 15_00326; DeviceType: resistor; Status: 2 - Checked and Approved; MountType: SMT; ComponentLink1Description: Datasheet; ComponentLink1URL: X:\01_Datasheets\RES_YAGEO_RC0805FR.pdf; Supplier 1: Farnell; Supplier Part Number 1: 9237461
R42 R43 R46 R47 = 15_10610: RESISTOR, 0805, 24k, 1%, SMD; Manufacturer: Yageo; AutoId: 673; Value2: 0W125; SubType: Metal film; Id: 15_10610; DeviceType: resistor; Status: 0 - Unchecked; MountType: SMT; ComponentLink1Description: Datasheet; ComponentLink1URL: X:\01_Datasheets\
R48-R53 = 15_00341: as R3 on sheet STM32F103; Id: 15_00341; DeviceType: resistor; Status: 0 - Unchecked; MountType: SMT; ComponentLink1Description: Datasheet; ComponentLink1URL: X:\01_Datasheets\RES_YAGEO_RC0805FR.pdf; Supplier 1: Farnell
R54 = 15_10613: RESISTOR, 0805, 240k, 1%, SMD; Manufacturer: Yageo; AutoId: 676; Value2: 0W125; SubType: Metal film; Id: 15_10613; DeviceType: resistor; Status: 0 - Unchecked; MountType: SMT; ComponentLink1Description: Datasheet; ComponentLink1URL: X:\01_Datasheets\
R55 = 15_00353: RESISTOR, 0805, 100K, 1%, SMD; Manufacturer: Yageo; Manufacturer PN: RC0805FR-07100K; AutoId: 353; Value2: 0W125; SubType: Metal film; Id: 15_00353; DeviceType: resistor; Status: 0 - Unchecked; MountType: SMT; ComponentLink1Description: Datasheet; ComponentLink1URL: X:\01_Datasheets\RES_YAGEO_RC0805FR.pdf; Supplier 1: Farnell
R56 = 15_00329: as R5 on sheet STM32F103; Id: 15_00329; DeviceType: resistor; Status: 2 - Checked and Approved; MountType: SMT; ComponentLink1Description: Datasheet; ComponentLink1URL: X:\01_Datasheets\RES_YAGEO_RC0805FR.pdf; Supplier 1: Farnell; Supplier Part Number 1: 9237496
R57 = 15_10614: RESISTOR, 0805, 249k, 1%, SMD; Manufacturer: Yageo; AutoId: 677; Value2: 0W125; SubType: Metal film; Id: 15_10614; DeviceType: resistor; Status: 0 - Unchecked; MountType: SMT; ComponentLink1Description: Datasheet; ComponentLink1URL: X:\01_Datasheets\
R58 = 15_00365: RESISTOR, 0805, 1M, 1%, SMD; Manufacturer: Yageo; Manufacturer PN: RC0805FR-071M; AutoId: 365; Value2: 0W125; SubType: Metal film; Id: 15_00365; DeviceType: resistor; Status: 0 - Unchecked; MountType: SMT; ComponentLink1Description: Datasheet; ComponentLink1URL: X:\01_Datasheets\RES_YAGEO_RC0805FR.pdf; Supplier 1: Farnell
R59 = 15_10612: RESISTOR, 0805, 160, 1%, SMD; Manufacturer: Yageo; AutoId: 675; Value2: 0W125; SubType: Metal film; Id: 15_10612; DeviceType: resistor; Status: 0 - Unchecked; MountType: SMT; ComponentLink1Description: Datasheet; ComponentLink1URL: X:\01_Datasheets\

## Sheet connector.SchDoc
size A; SheetNumber: 5; SheetTotal: 6
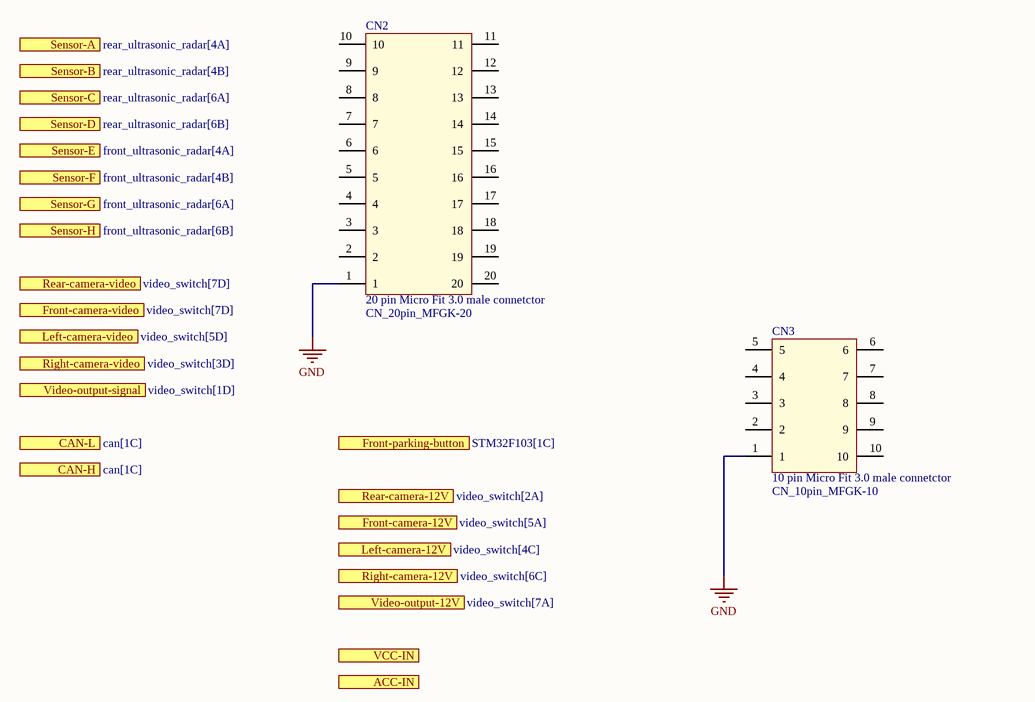
[diagram p4: connector.SchDoc]

### Parts
CN2  20 pin Micro Fit 3.0 male connetctor  [CN_20pin_MFGK-20]
CN3  10 pin Micro Fit 3.0 male connetctor  [CN_10pin_MFGK-10]

### Ports
ACC-IN, CAN-H (see can[1C]), CAN-L (see can[1C]), Front-camera-12V (see video_switch[5A]), Front-camera-video (see video_switch[7D]), Front-parking-button (see STM32F103[1C]), Left-camera-12V (see video_switch[4C]), Left-camera-video (see video_switch[5D]), Rear-camera-12V (see video_switch[2A]), Rear-camera-video (see video_switch[7D]), Right-camera-12V (see video_switch[6C]), Right-camera-video (see video_switch[3D]), Sensor-A (see rear_ultrasonic_radar[4A]), Sensor-B (see rear_ultrasonic_radar[4B]), Sensor-C (see rear_ultrasonic_radar[6A]), Sensor-D (see rear_ultrasonic_radar[6B]), Sensor-E (see front_ultrasonic_radar[4A]), Sensor-F (see front_ultrasonic_radar[4B]), Sensor-G (see front_ultrasonic_radar[6A]), Sensor-H (see front_ultrasonic_radar[6B]), VCC-IN, Video-output-12V (see video_switch[7A]), Video-output-signal (see video_switch[1D])

### Nets
GND: CN2.1 CN3.1

Not connected (* = marked no-connect by the designer): CN2 2 3 4 5 6 7 8 9 10 11 12 13 14 15 16 17 18 19 20; CN3 2 3 4 5 6 7 8 9 10

### Library data of the parts
CN2 = 02_10136: Molex, Micro-Fit 3.0, 43045, 20 Way, 2 Row, Right Angle PCB Header; Manufacturer PN: 43045-2000; AutoId: 177; Value2: 20 pin; Value3: 3.0 mm; DeviceType: Connector_; Id: 02_10136; Value1: CN_20pin_MFGK-20; Manufacturer: Molex; MountType: SMT; ComponentLink1Description: Datasheet; ComponentLink1URL: X:\01_Datasheets\CN_molex_micro_fit_430045.pdf; ComponentLink2Description: ComponentVerificationSheet; ComponentLink2URL: X:\02_ComponentVerificationSheets\; Supplier 1: kosmodrom.ua; Supplier Part Number 1: 00-00041123
CN3 = 02_10137: Molex, Micro-Fit 3.0, 43045, 10 Way, 2 Row, Right Angle PCB Header; Manufacturer PN: 43045-1000; AutoId: 179; Value2: 10 pin; Value3: 3.0 mm; DeviceType: Connector_; Id: 02_10137; Value1: CN_10pin_MFGK-10; Manufacturer: Molex; MountType: SMT; ComponentLink1Description: Datasheet; ComponentLink1URL: X:\01_Datasheets\CN_molex_micro_fit_430045.pdf; ComponentLink2Description: ComponentVerificationSheet; ComponentLink2URL: X:\02_ComponentVerificationSheets\; Supplier 1: kosmodrom.ua; Supplier Part Number 1: 00-00041120

## Sheet rear_ultrasonic_radar.SchDoc
size A3; SheetNumber: 6; SheetTotal: 6
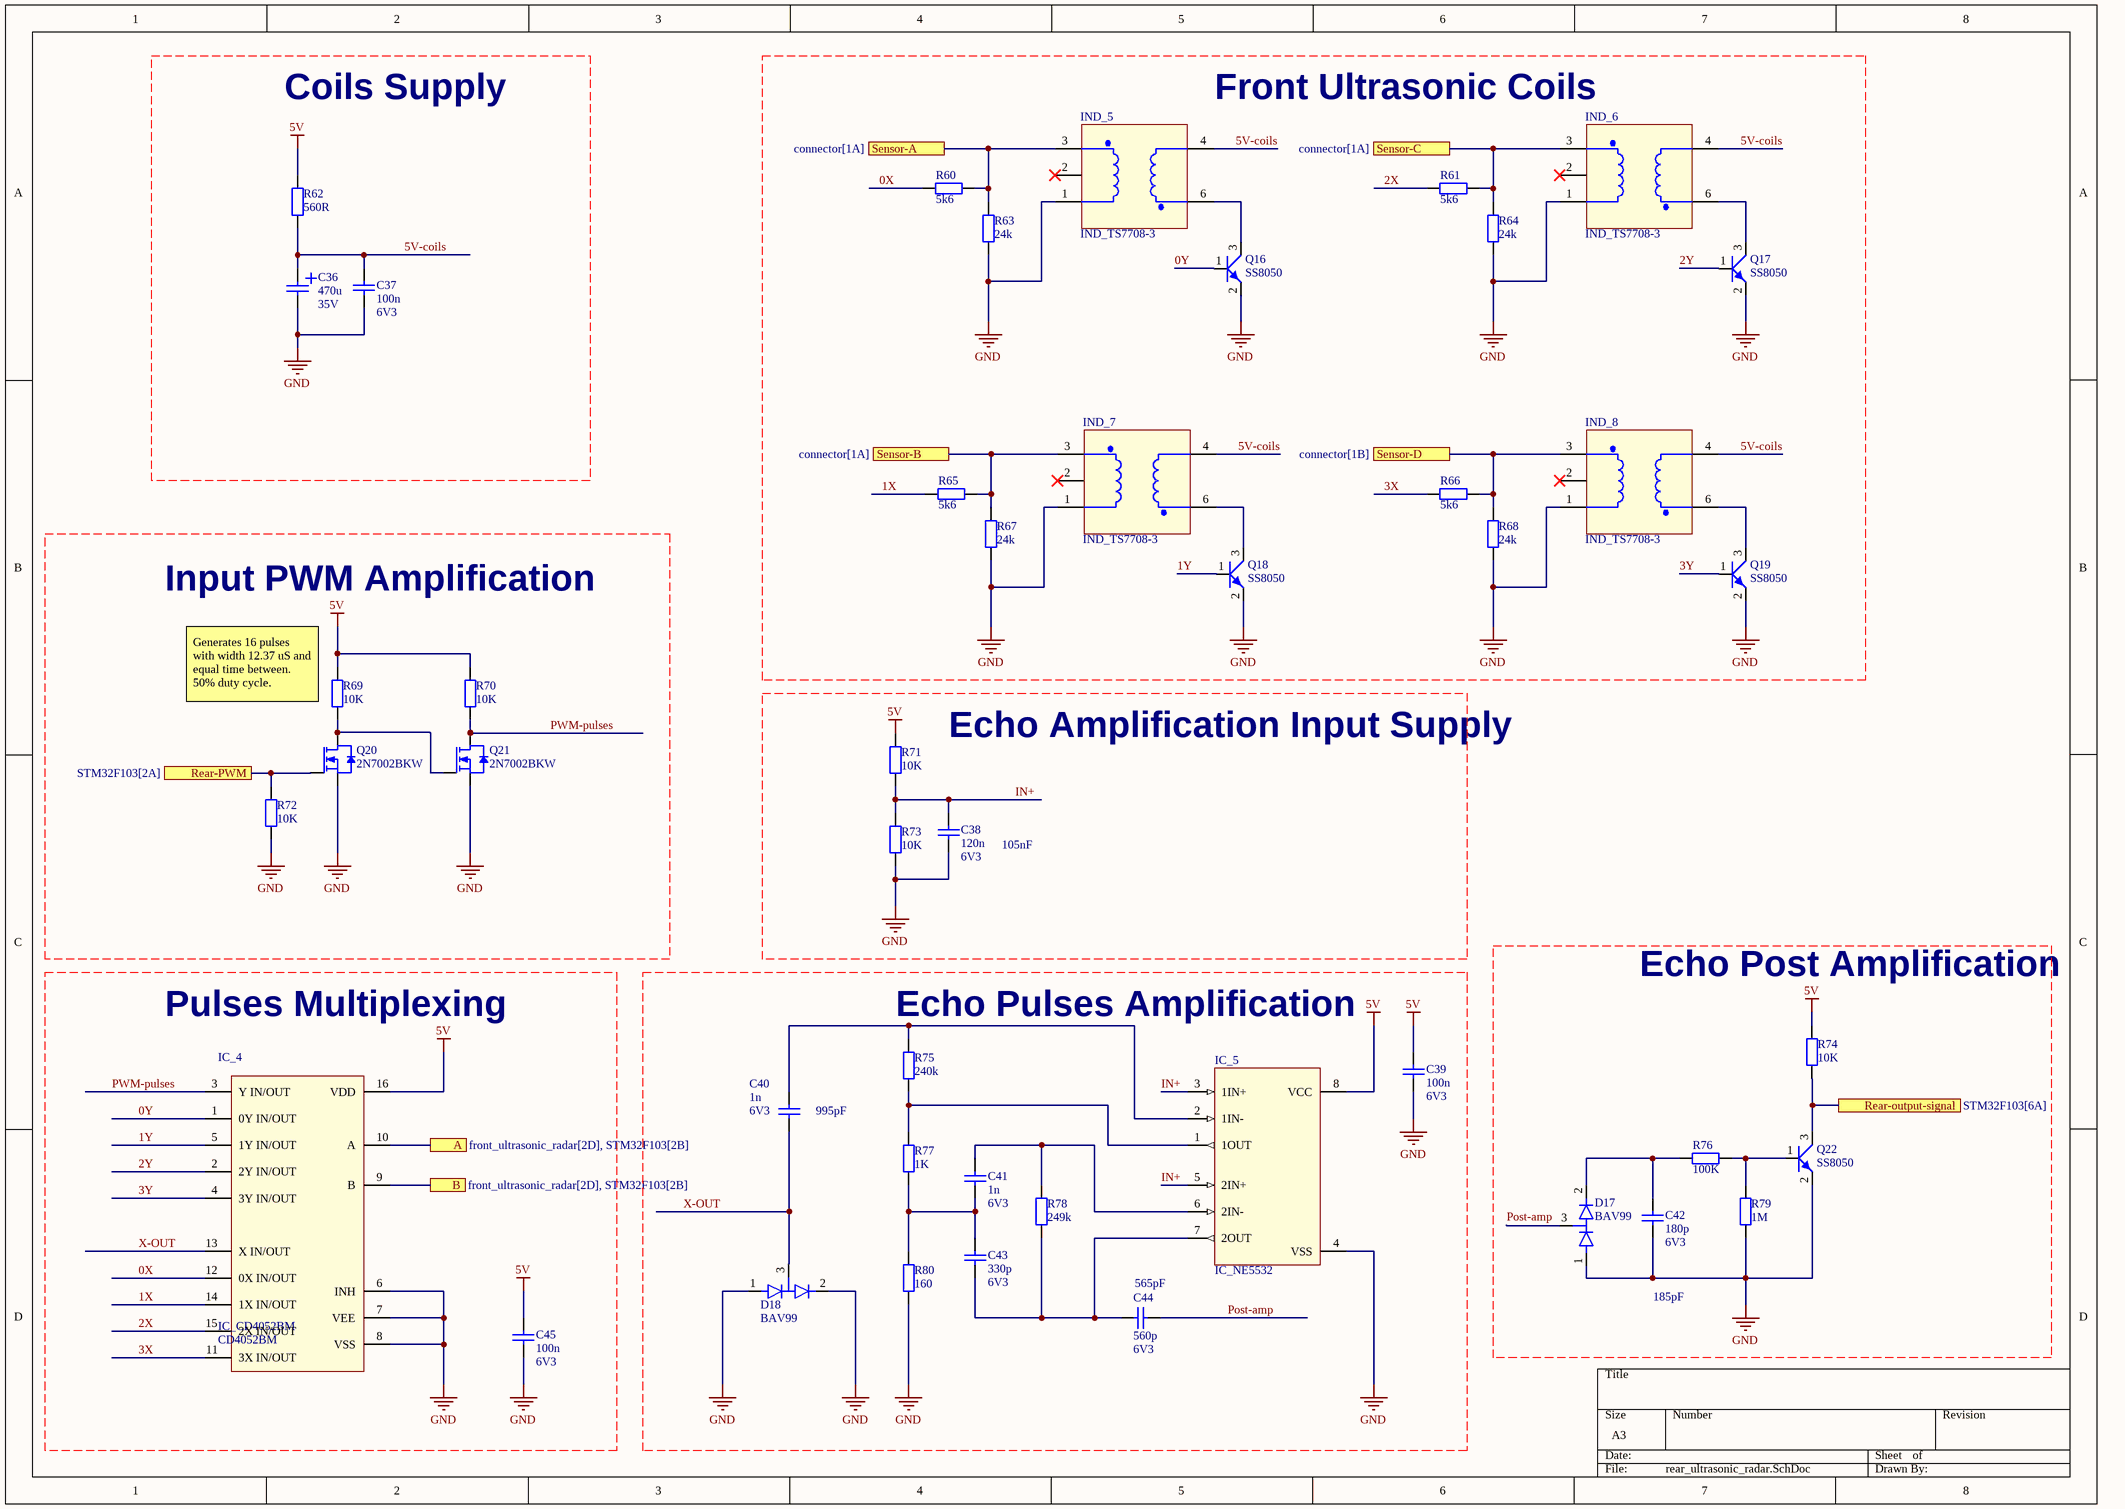
[diagram p5: rear_ultrasonic_radar.SchDoc]

### Parts
C36  Value1: 470u  Value2: 35V  [CAP_Panasonic_EEE-FK1V471SP]  (hidden comment: CAP_POL)
C37  Value1: 100n  Value2: 6V3  [CAPC2012X88N]  (hidden comment: CAP)
C38  Value1: 120n  Value2: 6V3  [CAPC2012X88N]  (hidden comment: CAP)
C39  Value1: 100n  Value2: 6V3  [CAPC2012X88N]  (hidden comment: CAP)
C40  Value1: 1n  Value2: 6V3  [CAPC2012X88N]  (hidden comment: CAP)
C41  Value1: 1n  Value2: 6V3  [CAPC2012X88N]  (hidden comment: CAP)
C42  Value1: 180p  Value2: 6V3  [CAPC2012X88N]  (hidden comment: CAP)
C43  Value1: 330p  Value2: 6V3  [CAPC2012X88N]  (hidden comment: CAP)
C44  Value1: 560p  Value2: 6V3  [CAPC2012X88N]  (hidden comment: CAP)
C45  Value1: 100n  Value2: 6V3  [CAPC2012X88N]  (hidden comment: CAP)
D17  Value1: BAV99  [DIO_BAV99-SOT23]  (hidden comment: High-speed double diode)
D18  Value1: BAV99  [DIO_BAV99-SOT23]  (hidden comment: High-speed double diode)
IC_4  IC_CD4052BM  Value1: CD4052BM  [SOP-16]
IC_5  IC_NE5532
IND_5  IND_TS7708-3
IND_6  IND_TS7708-3
IND_7  IND_TS7708-3
IND_8  IND_TS7708-3
Q16  Value1: SS8050  [SOT23]  (hidden comment: TRS_NPN_123)
Q17  Value1: SS8050  [SOT23]  (hidden comment: TRS_NPN_123)
Q18  Value1: SS8050  [SOT23]  (hidden comment: TRS_NPN_123)
Q19  Value1: SS8050  [SOT23]  (hidden comment: TRS_NPN_123)
Q20  Value1: 2N7002BKW  [SOT65P210X110-3N]  (hidden comment: TRS_FETN_123)
Q21  Value1: 2N7002BKW  [SOT65P210X110-3N]  (hidden comment: TRS_FETN_123)
Q22  Value1: SS8050  [SOT23]  (hidden comment: TRS_NPN_123)
R60  Value1: 5k6  [RESC2012X60N]  (hidden comment: RES)
R61  Value1: 5k6  [RESC2012X60N]  (hidden comment: RES)
R62  Value1: 560R  [RESC2012X60N]  (hidden comment: RES)
R63  Value1: 24k  [RESC2012X60N]  (hidden comment: RES)
R64  Value1: 24k  [RESC2012X60N]  (hidden comment: RES)
R65  Value1: 5k6  [RESC2012X60N]  (hidden comment: RES)
R66  Value1: 5k6  [RESC2012X60N]  (hidden comment: RES)
R67  Value1: 24k  [RESC2012X60N]  (hidden comment: RES)
R68  Value1: 24k  [RESC2012X60N]  (hidden comment: RES)
R69  Value1: 10K  [RESC2012X60N]  (hidden comment: RES)
R70  Value1: 10K  [RESC2012X60N]  (hidden comment: RES)
R71  Value1: 10K  [RESC2012X60N]  (hidden comment: RES)
R72  Value1: 10K  [RESC2012X60N]  (hidden comment: RES)
R73  Value1: 10K  [RESC2012X60N]  (hidden comment: RES)
R74  Value1: 10K  [RESC2012X60N]  (hidden comment: RES)
R75  Value1: 240k  [RESC2012X60N]  (hidden comment: RES)
R76  Value1: 100K  [RESC2012X60N]  (hidden comment: RES)
R77  Value1: 1K  [RESC2012X60N]  (hidden comment: RES)
R78  Value1: 249k  [RESC2012X60N]  (hidden comment: RES)
R79  Value1: 1M  [RESC2012X60N]  (hidden comment: RES)
R80  Value1: 160  [RESC2012X60N]  (hidden comment: RES)

### Ports
A (see front_ultrasonic_radar[2D], STM32F103[2B]), B (see front_ultrasonic_radar[2D], STM32F103[2B]), Rear-output-signal (see STM32F103[6A]), Rear-PWM (see STM32F103[2A]), Sensor-A (see connector[1A]), Sensor-B (see connector[1A]), Sensor-C (see connector[1A]), Sensor-D (see connector[1B])

### Nets
5V: C39.2 C45.2 IC_4.16(VDD) IC_5.8(VCC) R62.2 R69.2 R70.2 R71.1 R74.2
GND: C36.2 C37.1 C38.1 C39.1 C42.1 C45.1 D17.1(A1) D18.1(A1) D18.2(A2) IC_4.6(INH) IC_4.7(VEE) IC_4.8(VSS) IC_5.4(VSS) IND_5.1 IND_6.1 IND_7.1 IND_8.1 Q16.2(E) Q17.2(E) Q18.2(E) Q19.2(E) Q20.2(S) Q21.2(S) Q22.2(E) R63.1 R64.1 R67.1 R68.1 R72.1 R73.1 R79.1 R80.1
0X: IC_4.12(0X_IN/OUT) R60.2
0Y: IC_4.1(0Y_IN/OUT) Q16.1(B)
1X: IC_4.14(1X_IN/OUT) R65.2
1Y: IC_4.5(1Y_IN/OUT) Q18.1(B)
2X: IC_4.15(2X_IN/OUT) R61.2
2Y: IC_4.2(2Y_IN/OUT) Q17.1(B)
3X: IC_4.11(3X_IN/OUT) R66.2
3Y: IC_4.4(3Y_IN/OUT) Q19.1(B)
5V-coils: C36.1 C37.2 IND_5.4 IND_6.4 IND_7.4 IND_8.4 R62.1
A-out: IC_4.10(A) ; port A
B-out: IC_4.9(B) ; port B
IN+: C38.2 IC_5.3(1IN+) IC_5.5(2IN+) R71.2 R73.2
Post-amp: C44.1 D17.3(K)
PWM-pulses: IC_4.3(Y_IN/OUT) Q21.3(D) R70.1
X-OUT: C40.1 D18.3(K) IC_4.13(X_IN/OUT)
NetC40_2: C40.2 IC_5.2(1IN-) R75.1
NetC41_1: C41.1 IC_5.6(2IN-) R78.1
NetC41_2: C41.2 C43.2 R77.1 R80.2
NetC42_2: C42.2 D17.2(A2) R76.1
NetC43_1: C43.1 C44.2 IC_5.7(2OUT) R78.2
NetD1_21: Q22.3(C) R74.1 ; port Rear-output-signal
NetD1_31: Q20.1(G) R72.2 ; port Rear-PWM
NetIC_5_1: IC_5.1(1OUT) R75.2 R77.2
NetIND_5_3: IND_5.3(S2) R60.1 R63.2 ; port Sensor-A
NetIND_5_6: IND_5.6(S1) Q16.3(C)
NetIND_6_3: IND_6.3(S2) R61.1 R64.2 ; port Sensor-C
NetIND_6_6: IND_6.6(S1) Q17.3(C)
NetIND_7_3: IND_7.3(S2) R65.1 R67.2 ; port Sensor-B
NetIND_7_6: IND_7.6(S1) Q18.3(C)
NetIND_8_3: IND_8.3(S2) R66.1 R68.2 ; port Sensor-D
NetIND_8_6: IND_8.6(S1) Q19.3(C)
NetQ20_3: Q20.3(D) Q21.1(G) R69.1
NetQ22_1: Q22.1(B) R76.2 R79.2

Not connected (* = marked no-connect by the designer): IND_5 2*; IND_6 2*; IND_7 2*; IND_8 2*

### Notes on the sheet
- Coils Supply
- Front Ultrasonic Coils
- Input PWM Amplification
- (near R69) Generates 16 pulses with width 12.37 uS and equal time between. 50% duty cycle.
- Echo Amplification Input Supply
- (near C38) 105nF
- (near R74) Echo Post Amplification
- Pulses Multiplexing
- (near R75) Echo Pulses Amplification
- (near C40) 995pF
- (near C44) 565pF
- 185pF

### Library data of the parts
C36 = 01_01555: as C26 on sheet front_ultrasonic_radar; Id: 01_01555; DeviceType: capacitor; Status: 0 - Unchecked; MountType: SMT; ComponentLink1URL: X:\01_Datasheets\CAP_Panasonic_FKS.pdf; Supplier 1: Mouser; Supplier Part Number 1: 667-EEE-FK1V471SP; ComponentLink1Description: Datasheet
C37 C39 C45 = 01_00637: as C8 on sheet STM32F103; Id: 01_00637; Status: 2 - Checked and Approved; MountType: SMT; ComponentLink1URL: X:\01_Datasheets\CAP_KEMET_CxxxxCxxxXxRAC.pdf; Supplier 1: Farnell; Supplier Part Number 1: 80-C0805C104K9R; ComponentLink1Description: Datasheet
C38 = 01_00638: as C28 on sheet front_ultrasonic_radar; Id: 01_00638; Status: 2 - Checked and Approved; MountType: SMT; ComponentLink1URL: X:\01_Datasheets\CAP_KEMET_CxxxxCxxxXxRAC.pdf; Supplier 1: Farnell; ComponentLink1Description: Datasheet
C40 C41 = 01_00613: as C30 on sheet front_ultrasonic_radar; Id: 01_00613; Status: 2 - Checked and Approved; MountType: SMT; ComponentLink1URL: X:\01_Datasheets\CAP_KEMET_CxxxxCxxxXxRAC.pdf; Supplier 1: Farnell; ComponentLink1Description: Datasheet
C42 = 01_00604: as C32 on sheet front_ultrasonic_radar; Id: 01_00604; Status: 2 - Checked and Approved; MountType: SMT; ComponentLink1URL: X:\01_Datasheets\CAP_KEMET_CxxxxCxxxXxRAC.pdf; Supplier 1: Farnell; ComponentLink1Description: Datasheet
C43 = 01_00607: as C33 on sheet front_ultrasonic_radar; Id: 01_00607; Status: 2 - Checked and Approved; MountType: SMT; ComponentLink1URL: X:\01_Datasheets\CAP_KEMET_CxxxxCxxxXxRAC.pdf; Supplier 1: Farnell; ComponentLink1Description: Datasheet
C44 = 01_00610: as C34 on sheet front_ultrasonic_radar; Id: 01_00610; Status: 2 - Checked and Approved; MountType: SMT; ComponentLink1URL: X:\01_Datasheets\CAP_KEMET_CxxxxCxxxXxRAC.pdf; Supplier 1: Farnell; ComponentLink1Description: Datasheet
D17 D18 = 03_00102: as D15 on sheet front_ultrasonic_radar; Id: 03_00102; Manufacturer PN: BAV99; DeviceType: diode; Status: 0 - Unchecked; MountType: SMD; ComponentLink1Description: Datasheet; ComponentLink1URL: X:\01_Datasheets\BAV99.pdf; ComponentLink2Description: ComponentVerificationSheet; ComponentLink2URL: X:\02_ComponentVerificationSheets\
IC_4 = 07_00294: as IC_2 on sheet front_ultrasonic_radar; Id: 07_00294; Manufacturer PN: CD4052BM; Status: 0 - Unchecked; MountType: SMT; ComponentLink1Description: Datasheet; ComponentLink1URL: X:\01_Datasheets\IC_CD4052BM.pdf; ComponentLink2Description: ComponentVerificationSheet; ComponentLink2URL: X:\02_ComponentVerificationSheets\
IC_5 = IC_NE5532: as IC_3 on sheet front_ultrasonic_radar
IND_5-IND_8 = IND_TS7708-3: as IND_1 on sheet front_ultrasonic_radar
Q16-Q19 Q22 = 19_00050: as Q9 on sheet front_ultrasonic_radar; Id: 19_00050; Manufacturer PN: SS8050; DeviceType: transistor; SubType: NPN; Status: 0 - Unchecked; MountType: SMT; ComponentLink1Description: Datasheet; ComponentLink1URL: X:\01_Datasheets\SS8050.pdf; ComponentLink2Description: ComponentVerificationSheet; ComponentLink2URL: X:\02_ComponentVerificationSheets\
Q20 Q21 = 19_00024: as Q13 on sheet front_ultrasonic_radar; Id: 19_00024; Value2: n/a; Manufacturer: NXP; Manufacturer PN: 2N7002BKW; SubType: MOSFET; Status: 2 - Checked and Approved; MountType: SMD; ComponentLink1Description: Datasheet; ComponentLink1URL: X:\01_dataSheets\TRS_NXP_2N7002BKW.pdf; ComponentLink2Description: ComponentVerificationSheet; ComponentLink2URL: X:\02_ComponentVerificationSheets\; Supplier 1: Farnell; Supplier Part Number 1: 1894713RL
R60 R61 R65 R66 = 15_10611: as R39 on sheet front_ultrasonic_radar; Id: 15_10611; DeviceType: resistor; Status: 0 - Unchecked; MountType: SMT; ComponentLink1Description: Datasheet; ComponentLink1URL: X:\01_Datasheets\
R62 = 15_00326: as R41 on sheet front_ultrasonic_radar; Id: 15_00326; DeviceType: resistor; Status: 2 - Checked and Approved; MountType: SMT; ComponentLink1Description: Datasheet; ComponentLink1URL: X:\01_Datasheets\RES_YAGEO_RC0805FR.pdf; Supplier 1: Farnell; Supplier Part Number 1: 9237461
R63 R64 R67 R68 = 15_10610: as R42 on sheet front_ultrasonic_radar; Id: 15_10610; DeviceType: resistor; Status: 0 - Unchecked; MountType: SMT; ComponentLink1Description: Datasheet; ComponentLink1URL: X:\01_Datasheets\
R69-R74 = 15_00341: as R3 on sheet STM32F103; Id: 15_00341; DeviceType: resistor; Status: 0 - Unchecked; MountType: SMT; ComponentLink1Description: Datasheet; ComponentLink1URL: X:\01_Datasheets\RES_YAGEO_RC0805FR.pdf; Supplier 1: Farnell
R75 = 15_10613: as R54 on sheet front_ultrasonic_radar; Id: 15_10613; DeviceType: resistor; Status: 0 - Unchecked; MountType: SMT; ComponentLink1Description: Datasheet; ComponentLink1URL: X:\01_Datasheets\
R76 = 15_00353: as R55 on sheet front_ultrasonic_radar; Id: 15_00353; DeviceType: resistor; Status: 0 - Unchecked; MountType: SMT; ComponentLink1Description: Datasheet; ComponentLink1URL: X:\01_Datasheets\RES_YAGEO_RC0805FR.pdf; Supplier 1: Farnell
R77 = 15_00329: as R5 on sheet STM32F103; Id: 15_00329; DeviceType: resistor; Status: 2 - Checked and Approved; MountType: SMT; ComponentLink1Description: Datasheet; ComponentLink1URL: X:\01_Datasheets\RES_YAGEO_RC0805FR.pdf; Supplier 1: Farnell; Supplier Part Number 1: 9237496
R78 = 15_10614: as R57 on sheet front_ultrasonic_radar; Id: 15_10614; DeviceType: resistor; Status: 0 - Unchecked; MountType: SMT; ComponentLink1Description: Datasheet; ComponentLink1URL: X:\01_Datasheets\
R79 = 15_00365: as R58 on sheet front_ultrasonic_radar; Id: 15_00365; DeviceType: resistor; Status: 0 - Unchecked; MountType: SMT; ComponentLink1Description: Datasheet; ComponentLink1URL: X:\01_Datasheets\RES_YAGEO_RC0805FR.pdf; Supplier 1: Farnell
R80 = 15_10612: as R59 on sheet front_ultrasonic_radar; Id: 15_10612; DeviceType: resistor; Status: 0 - Unchecked; MountType: SMT; ComponentLink1Description: Datasheet; ComponentLink1URL: X:\01_Datasheets\

## Nets that join several sheets
5V: STM32F103 (R1.2 R2.2), can (5 pins), front_ultrasonic_radar (9 pins), rear_ultrasonic_radar (9 pins)
GND: STM32F103 (31 pins), can (11 pins), front_ultrasonic_radar (32 pins), connector (CN2.1 CN3.1), rear_ultrasonic_radar (32 pins)
VCC-IN: STM32F103 (D4.1 D19.1), can (D13.1)
A-out: STM32F103 (D1.28 R1.1), front_ultrasonic_radar (IC_2.10), rear_ultrasonic_radar (IC_4.10)
B-out: STM32F103 (D1.30 R2.1), front_ultrasonic_radar (IC_2.9), rear_ultrasonic_radar (IC_4.9)
NetD1_16: STM32F103 (D1.16), can (IC_1.8 R36.2)
NetD1_21: STM32F103 (D1.21), rear_ultrasonic_radar (Q22.3 R74.1)
NetD1_29: STM32F103 (D1.29), front_ultrasonic_radar (Q13.1 R51.2)
NetD1_31: STM32F103 (D1.31), rear_ultrasonic_radar (Q20.1 R72.2)
NetD1_32: STM32F103 (D1.32), can (IC_1.4)
NetD1_33: STM32F103 (D1.33), can (IC_1.1)
NetD1_38: STM32F103 (D1.38), front_ultrasonic_radar (Q15.3 R53.1)